# Altium schematic sheet schem.SchDoc
size A; SheetNumber: 1; SheetTotal: 1
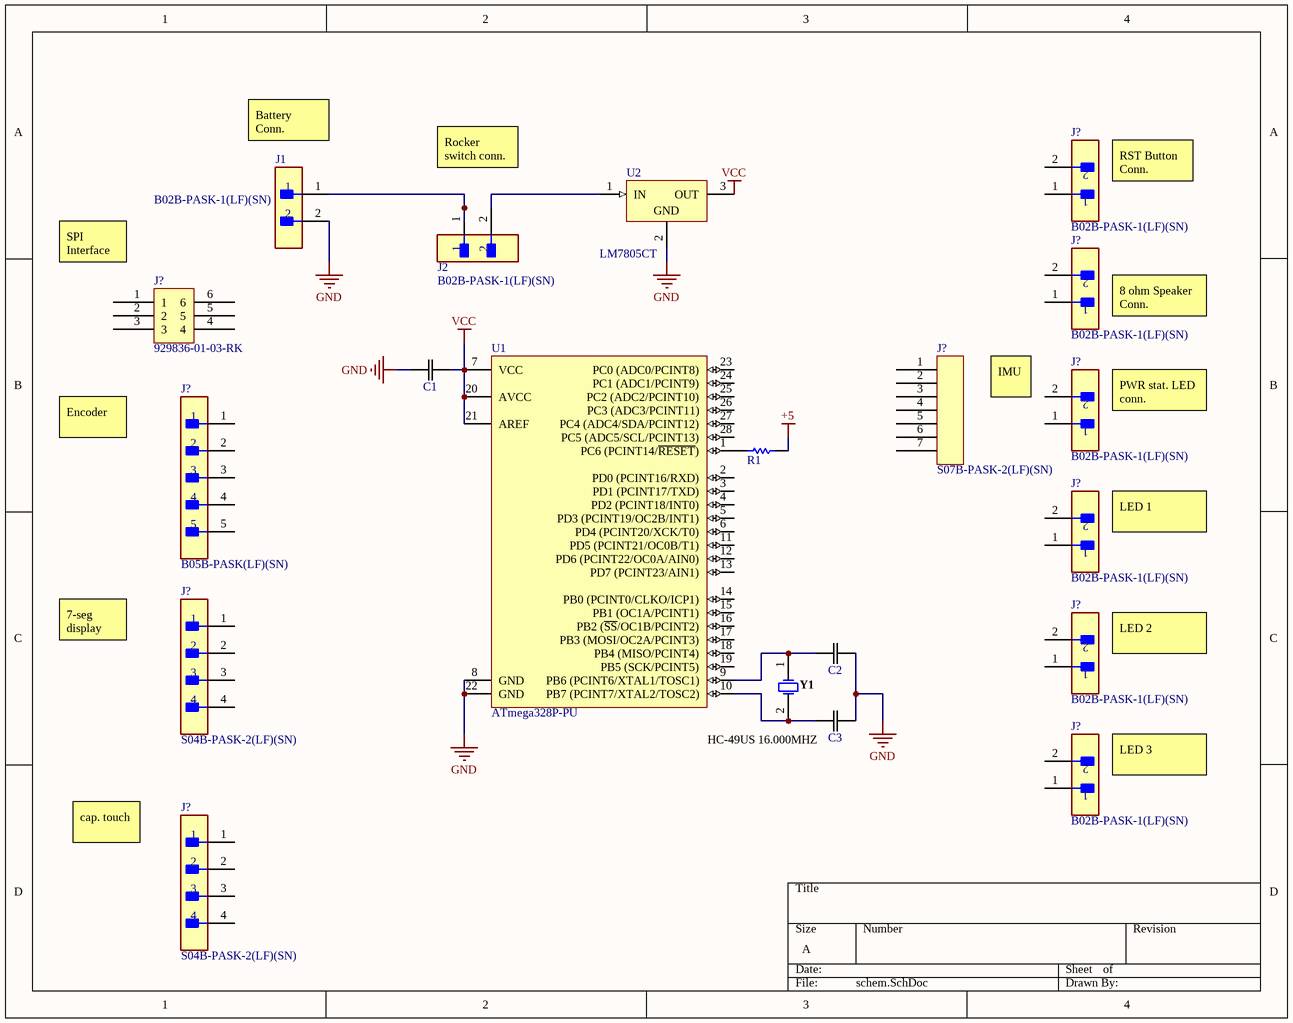
[diagram p0: schem.SchDoc]

## Parts
(Parts that share a designator on the sheet are numbered #1, #2 ... from top to bottom, then left to right.)
C1  Cap, 22pF, ceramic, TH  [New footprint 1]  (value not drawn)
C2  Cap, 22pF, ceramic, TH  [New footprint 1]  (value not drawn)
C3  Cap, 22pF, ceramic, TH  [New footprint 1]  (value not drawn)
J1  B02B-PASK-1(LF)(SN)  [FP-B02B-PASK-1_LF_SN-MFG]
J2  B02B-PASK-1(LF)(SN)  [FP-B02B-PASK-1_LF_SN-MFG]
J?#1  B02B-PASK-1(LF)(SN)  [FP-B02B-PASK-1_LF_SN-MFG]
J?#2  929836-01-03-RK  [929836-01-03-RK-Footprint-1]
J?#3  B02B-PASK-1(LF)(SN)  [FP-B02B-PASK-1_LF_SN-MFG]
J?#4  S07B-PASK-2(LF)(SN)  [S07B-PASK-2(LF)(SN)-Footprint-1]
J?#5  B05B-PASK(LF)(SN)  [FP-B05B-PASK_LF_SN-MFG]
J?#6  B02B-PASK-1(LF)(SN)  [FP-B02B-PASK-1_LF_SN-MFG]
J?#7  B02B-PASK-1(LF)(SN)  [FP-B02B-PASK-1_LF_SN-MFG]
J?#8  S04B-PASK-2(LF)(SN)  [FP-S04B-PASK-2_LF_SN-MFG]
J?#9  B02B-PASK-1(LF)(SN)  [FP-B02B-PASK-1_LF_SN-MFG]
J?#10  B02B-PASK-1(LF)(SN)  [FP-B02B-PASK-1_LF_SN-MFG]
J?#11  S04B-PASK-2(LF)(SN)  [FP-S04B-PASK-2_LF_SN-MFG]
R1  1k Through-Hole 1/4W  [RESA60-630X240]  (value not drawn)
U1  ATmega328P-PU  [28P3]
U2  LM7805CT  [FAIR-TO-220-3]
Y1  HC-49US 16.000MHZ  [JPY-HC-49US]

## Nets
+5: R1.2
GND: C1.1 C2.2 C3.2 J1.2 U1.8(GND) U1.22(GND) U2.2(GND)
VCC: C1.2 U1.7(VCC) U1.20(AVCC) U1.21(AREF) U2.3(OUT)
NetC2_1: C2.1 U1.9(PB6_(PCINT6/XTAL1/TOSC1)) Y1.1
NetC3_1: C3.1 U1.10(PB7_(PCINT7/XTAL2/TOSC2)) Y1.2
NetJ1_1: J1.1 J2.1
NetJ2_2: J2.2 U2.1(IN)
NetR1_1: R1.1 U1.1(PC6_(PCINT14/~{RESET}))

Not connected (* = marked no-connect by the designer): J?#1 1 2; J?#2 1 2 3 4 5 6; J?#3 1 2; J?#4 1 2 3 4 5 6 7; J?#5 1 2 3 4 5; J?#6 1 2; J?#7 1 2; J?#8 1 2 3 4; J?#9 1 2; J?#10 1 2; J?#11 1 2 3 4; U1 2(PD0_(PCINT16/RXD)) 3(PD1_(PCINT17/TXD)) 4(PD2_(PCINT18/INT0)) 5(PD3_(PCINT19/OC2B/INT1)) 6(PD4_(PCINT20/XCK/T0)) 11(PD5_(PCINT21/OC0B/T1)) 12(PD6_(PCINT22/OC0A/AIN0)) 13(PD7_(PCINT23/AIN1)) 14(PB0_(PCINT0/CLKO/ICP1)) 15(PB1_(OC1A/PCINT1)) 16(PB2_(~{SS}/OC1B/PCINT2)) 17(PB3_(MOSI/OC2A/PCINT3)) 18(PB4_(MISO/PCINT4)) 19(PB5_(SCK/PCINT5)) 23(PC0_(ADC0/PCINT8)) 24(PC1_(ADC1/PCINT9)) 25(PC2_(ADC2/PCINT10)) 26(PC3_(ADC3/PCINT11)) 27(PC4_(ADC4/SDA/PCINT12)) 28(PC5_(ADC5/SCL/PCINT13))

## Notes on the sheet
- Battery Conn.
- Rocker switch conn.
- (near J?#1) RST Button Conn.
- (near J?#2) SPI Interface
- (near J?#3) 8 ohm Speaker Conn.
- Encoder
- (near J?#6) IMU
- (near J?#6) PWR stat. LED conn.
- (near J?#7) LED 1
- 7-seg display
- (near J?#9) LED 2
- (near J?#10) LED 3
- cap. touch

## Library data of the parts
C1-C3 = CMP-001-00113-1
J1 J2 J?#1 J?#3 J?#6 J?#7 J?#9 J?#10 = CMP-17439-000415-1: CONN HEADER VERT 2POS 2MM; Number of Contacts: 2; Current Rating: 3A; Insulation Resistance: 1GR; Mated Stacking Heights: 14.9mm; Voltage Rating: 250V; Gender: Male; Pitch: 2mm; Orientation: Straight; Contact Finish - Mating: TIN; Mount: Through Hole; Contact Type: Male Pin; Number of Rows: 1; Fastening Type: Ramp; Series: PA; Connector Type: Header; Insulation Color: Natural; Flammability Rating: UL94 V-0; Material: Polybutylene; Contact Shape: Square; Contact Plating: Tin; Insulation Material: PBT; Max Operating Temperature: 85°C; Housing Color: White; Number of Positions: 2; Contact Material: Copper Alloy; Min Operating Temperature: -25°C; Lead Free: Lead Free; Contact Mating Length: 0.126inch; Termination: Solder; Packaging: Bulk; Color: Natural
J?#2 = CMP-002-00092-1: 3x2 male header
J?#4 = CMP-002-00091-1: Conn Shrouded Header HDR 7 POS 2mm Solder RA Thru-Hole Box
J?#5 = CMP-17439-000143-1: CONN HEADER VERT 5POS 2MM; Number of Positions: 5; Voltage Rating: 250V; Gender: Male; Mated Stacking Heights: 14.9mm; Contact Material: Copper Alloy; Contact Type: Male Pin; Contact Finish - Mating: TIN; Insulation Material: PBT; Contact Plating: Tin; Contact Mating Length: 0.126inch; Fastening Type: Ramp; Contact Shape: Square; Packaging: Bulk; Color: Natural; Mount: Through Hole; Housing Color: White; Termination: Kinked Pin; Series: PA; Number of Rows: 1; Lead Free: Lead Free; Flammability Rating: UL94 V-0; Insulation Color: Natural; Number of Contacts: 5; Connector Type: Header; Pitch: 2mm
J?#8 J?#11 = CMP-17439-000283-1: CONN HEADER R/A 4POS 2MM; Max Current Rating: 3A; Contact Resistance: 20mR; Max Voltage Rating (AC): 250V; Number of Positions: 4; Orientation: Right Angle; Contact Type: Male Pin; Insulation Material: PBT; Contact Shape: Square; Series: PA; Contact Mating Length: 0.126inch; Fastening Type: Ramp; Contact Material: Copper Alloy; Termination: Solder; Housing Color: White; Length: 10mm; Contact Plating: Copper; Packaging: Bulk; Max Operating Temperature: 85°C; Connector Type: Header; Number of Rows: 1; Flammability Rating: UL94 V-0; Min Operating Temperature: -25°C; Insulation Color: Natural; Current Rating: 3A; Depth: 11.7mm; Number of Contacts: 4; Mount: Through Hole; Color: Natural; Pitch: 2mm; Contact Finish - Mating: TIN; Lead Free: Lead Free; Voltage Rating: 250V
R1 = CMP-009-00195-1: RES 1K OHM 1/4W 1% AXIAL; Resistance: 1kR; Voltage Rating (DC): 200V; Temperature Coefficient: 100ppm/°C; Lead Diameter: 0.6mm; Max Power Dissipation: 250mW; Voltage Rating: 250V; Min Operating Temperature: -55°C; Max Operating Temperature: 155°C; Case/Package: Axial; Series: MFR; Tolerance: 1%; Lead Free: Lead Free; Packaging: Bulk; Length: 0.248inch; Mount: Through Hole; Width: 6.3mm; Termination: Axial; RoHS Compliant: Yes; Package Quantity: 200; Number of Terminations: 2; Power Rating: 250mW; Resistor Type: Metal Film
U1 = CMP-0095-00013-2: 8-bit AVR Microcontroller, 32KB Flash, 1KB EEPROM, 2KB SRAM, 28-pin PDIP, Industrial Grade (-40°C to 85°C); RevisionNote: DatasheetVersion updated. URLs added.; PackageVersion: revB, Sep-2001; PackageDescription: 28-lead (0.300"/7.62mm Wide) Plastic Dual Inline Package (PDIP); DatasheetVersion: revD, May-2011; ComponentLink1Description: Manufacturer URL; ComponentLink1URL: http://www.atmel.com/; PackageReference: 28P3; ComponentLink2Description: ATmega48A/48PA/88A/88PA/168A/168PA/328/328P Datasheet; ComponentLink3URL: http://www.atmel.com/dyn/resources/prod_documents/8271S.pdf; ComponentLink2URL: http://www.atmel.com/dyn/resources/prod_documents/8271.pdf; ComponentLink3Description: ATmega48A/48PA/88A/88PA/168A/168PA/328/328P Summary
U2 = CMP-2000-04938-1: Positive Voltage Regulator, 5 V, 1 A, -40 to 125 degC, 3-Pin TO-220, RoHS, Tube; Manufacturer: FairchildSemiconductor; Maximum Input Voltage: 35V; Maximum Quiescent Current: 8mA; Load Regulation: 100mV; Maximum Output Current: 2.2(Typ)A; Output Type: Fixed; Typical Dropout Voltage @ Current: 2@1AV; Rad Hard: No; Output Voltage: 5V; Accuracy: ±4%; Number of Outputs: 1; Category: LinearRegulator; Package Description: 3-Pin Through Hole Device, Body 10 x 4.5 mm, Pitch 2.54 mm; Packaging: Rail/Tube; Mounting: ThroughHole; Polarity: Positive; Manufacturer URL: https://www.fairchildsemi.com/; Line Regulation: 100mV; Datasheet Version: Aug-12; Datasheet URL: https://datasheet.ciiva.com/26904/lm7805ct-26904988.pdf; Package Reference: TO-220; Package URL: https://www.fairchildsemi.com/package-drawings/TO/TO220B03.pdf; Package: 3TO-220AB; Operating Temperature: -40to125degC; Type: Linear
Y1 = CMP-003-00005-1: Crystal, 16 MHz, +/- 30 ppm, 18 pF, -20 to 70 degC, 2-Pin THD; Manufacturer: Jing peng yuan; Frequency: 16MHz; Package Description: 2-Pin Throug Hole Device, Body 11.05 x 4.65 mm, Pitch 4.9 mm; Package Reference: HC-49US; Datasheet Version: May-15; Case/Package: HC-49US; Mounting Technology: TH; Datasheet URL: https://statics3.seeedstudio.com/images/opl/datasheet/306010014.pdf; RoHS Compliant: Unknown